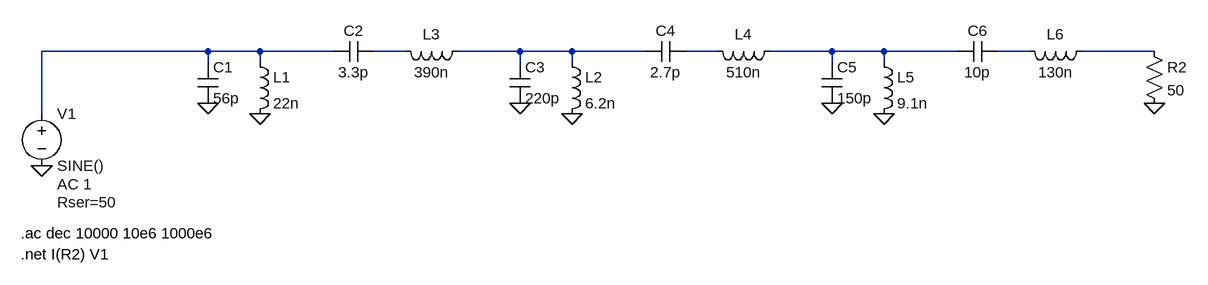
[diagram p0: schematic VHF-Passband.asc]
VHF-Passband.asc, the LTspice schematic file:
Version 4
SHEET 1 1768 680
WIRE 256 48 0 48
WIRE 336 48 256 48
WIRE 448 48 336 48
WIRE 560 48 512 48
WIRE 736 48 640 48
WIRE 816 48 736 48
WIRE 928 48 816 48
WIRE 1040 48 992 48
WIRE 1216 48 1120 48
WIRE 1296 48 1216 48
WIRE 1408 48 1296 48
WIRE 1520 48 1472 48
WIRE 1712 48 1600 48
WIRE 256 64 256 48
WIRE 336 64 336 48
WIRE 736 64 736 48
WIRE 816 64 816 48
WIRE 1216 64 1216 48
WIRE 1296 64 1296 48
WIRE 0 144 0 48
FLAG 0 224 0
FLAG 1712 128 0
FLAG 1296 144 0
FLAG 1216 128 0
FLAG 816 144 0
FLAG 736 128 0
FLAG 336 144 0
FLAG 256 128 0
SYMBOL voltage 0 128 R0
WINDOW 123 24 124 Left 2
WINDOW 39 24 152 Left 2
SYMATTR Value2 AC 1
SYMATTR SpiceLine Rser=50
SYMATTR InstName V1
SYMATTR Value SINE()
SYMBOL cap 240 64 R0
SYMATTR InstName C1
SYMATTR Value 56p
SYMBOL ind 320 48 R0
SYMATTR InstName L1
SYMATTR Value 22n
SYMBOL cap 512 32 R90
WINDOW 0 0 32 VBottom 2
WINDOW 3 32 32 VTop 2
SYMATTR InstName C2
SYMATTR Value 3.3p
SYMBOL ind 656 32 R90
WINDOW 0 5 56 VBottom 2
WINDOW 3 32 56 VTop 2
SYMATTR InstName L3
SYMATTR Value 390n
SYMBOL cap 720 64 R0
SYMATTR InstName C3
SYMATTR Value 220p
SYMBOL ind 800 48 R0
SYMATTR InstName L2
SYMATTR Value 6.2n
SYMBOL cap 992 32 R90
WINDOW 0 0 32 VBottom 2
WINDOW 3 32 32 VTop 2
SYMATTR InstName C4
SYMATTR Value 2.7p
SYMBOL ind 1136 32 R90
WINDOW 0 5 56 VBottom 2
WINDOW 3 32 56 VTop 2
SYMATTR InstName L4
SYMATTR Value 510n
SYMBOL cap 1200 64 R0
SYMATTR InstName C5
SYMATTR Value 150p
SYMBOL ind 1280 48 R0
SYMATTR InstName L5
SYMATTR Value 9.1n
SYMBOL cap 1472 32 R90
WINDOW 0 0 32 VBottom 2
WINDOW 3 32 32 VTop 2
SYMATTR InstName C6
SYMATTR Value 10p
SYMBOL ind 1616 32 R90
WINDOW 0 5 56 VBottom 2
WINDOW 3 32 56 VTop 2
SYMATTR InstName L6
SYMATTR Value 130n
SYMBOL res 1696 32 R0
SYMATTR InstName R2
SYMATTR Value 50
TEXT -32 328 Left 2 !.ac dec 10000 10e6 1000e6
TEXT -32 360 Left 2 !.net I(R2) V1

The netlist it stands for:
* VHF-Passband.asc
V1 N001 0 SINE() AC 1 Rser=50
C1 N001 0 56p
L1 N001 0 22n
C2 N002 N001 3.3p
L3 N003 N002 390n
C3 N003 0 220p
L2 N003 0 6.2n
C4 N004 N003 2.7p
L4 N005 N004 510n
C5 N005 0 150p
L5 N005 0 9.1n
C6 N006 N005 10p
L6 N007 N006 130n
R2 N007 0 50
.ac dec 10000 10e6 1000e6
.net I(R2) V1
.backanno
.end